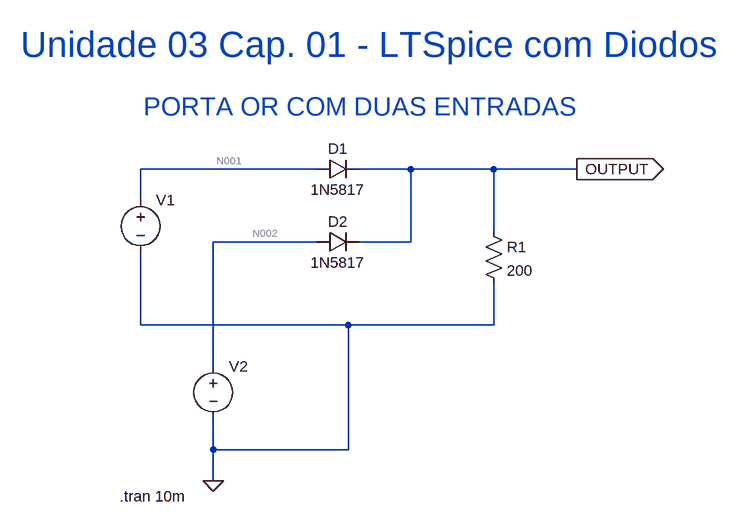
[diagram p0: schematic LTSpice_porta_or.asc]
LTSpice_porta_or.asc, the LTspice schematic file:
Version 4.1
SHEET 1 880 680
WIRE 208 128 -64 128
WIRE 352 128 272 128
WIRE 480 128 352 128
WIRE 608 128 480 128
WIRE -64 176 -64 128
WIRE 480 224 480 128
WIRE 208 240 48 240
WIRE 352 240 352 128
WIRE 352 240 272 240
WIRE -64 368 -64 256
WIRE 256 368 -64 368
WIRE 480 368 480 304
WIRE 480 368 256 368
WIRE 48 432 48 240
WIRE 48 560 48 512
WIRE 256 560 256 368
WIRE 256 560 48 560
WIRE 48 608 48 560
FLAG 48 608 0
FLAG 608 128 OUTPUT
IOPIN 608 128 Out
DATAFLAG 48 560 ""
SYMBOL diode 208 144 R270
WINDOW 0 32 32 VTop 2
WINDOW 3 0 32 VBottom 2
SYMATTR InstName D1
SYMATTR Value 1N5817
SYMATTR Description Diode
SYMATTR Type diode
SYMBOL diode 208 256 R270
WINDOW 0 32 32 VTop 2
WINDOW 3 0 32 VBottom 2
SYMATTR InstName D2
SYMATTR Value 1N5817
SYMATTR Description Diode
SYMATTR Type diode
SYMBOL voltage -64 160 R0
WINDOW 3 24 96 Invisible 2
WINDOW 123 0 0 Left 0
WINDOW 39 24 124 Left 2
SYMATTR InstName V1
SYMATTR Value PULSE(0 5 0 10n 10n 2.5m 5m)
SYMBOL res 464 208 R0
SYMATTR InstName R1
SYMATTR Value 200
SYMATTR SpiceLine tol=1 pwr=0.1
SYMBOL voltage 48 416 R0
WINDOW 3 24 96 Invisible 2
WINDOW 123 0 0 Left 0
WINDOW 39 0 0 Left 0
SYMATTR InstName V2
SYMATTR Value PULSE(0 5 1m 10n 10n 2.5m 5m)
TEXT 272 32 Center 4 ;PORTA OR COM DUAS ENTRADAS
TEXT -96 632 Left 2 !.tran 10m
TEXT 288 -64 Center 5 ;Unidade 03 Cap. 01 - LTSpice com Diodos

The netlist it stands for:
* LTSpice_porta_or.asc
D1 N001 OUTPUT 1N5817
D2 N002 OUTPUT 1N5817
V1 N001 0 PULSE(0 5 0 10n 10n 2.5m 5m)
R1 OUTPUT 0 200 tol=1 pwr=0.1
V2 N002 0 PULSE(0 5 1m 10n 10n 2.5m 5m)
.model D D
.lib standard.dio
* PORTA OR COM DUAS ENTRADAS
.tran 10m
* Unidade 03 Cap. 01 - LTSpice com Diodos
.backanno
.end

* Results of the author's LTspice run, read from the files saved beside the schematic
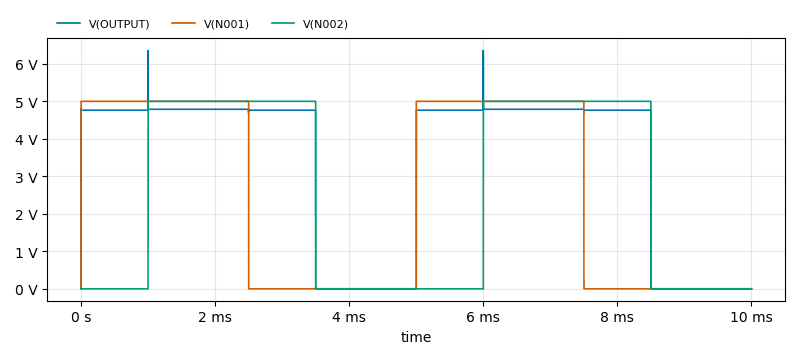
[diagram p1: Transient Analysis of LTSpice_porta_or.asc, plotted from the saved traces]
* Transient Analysis, 1 run:
*   V(OUTPUT): min -66.89 µV, max 6.359 V, average 3.342 V, rms 3.994 V, last 0 V
*   V(N001): min 0 V, max 5 V, average 2.5 V, rms 3.536 V, last 0 V
*   V(N002): min 0 V, max 5 V, average 2.5 V, rms 3.536 V, last 0 V